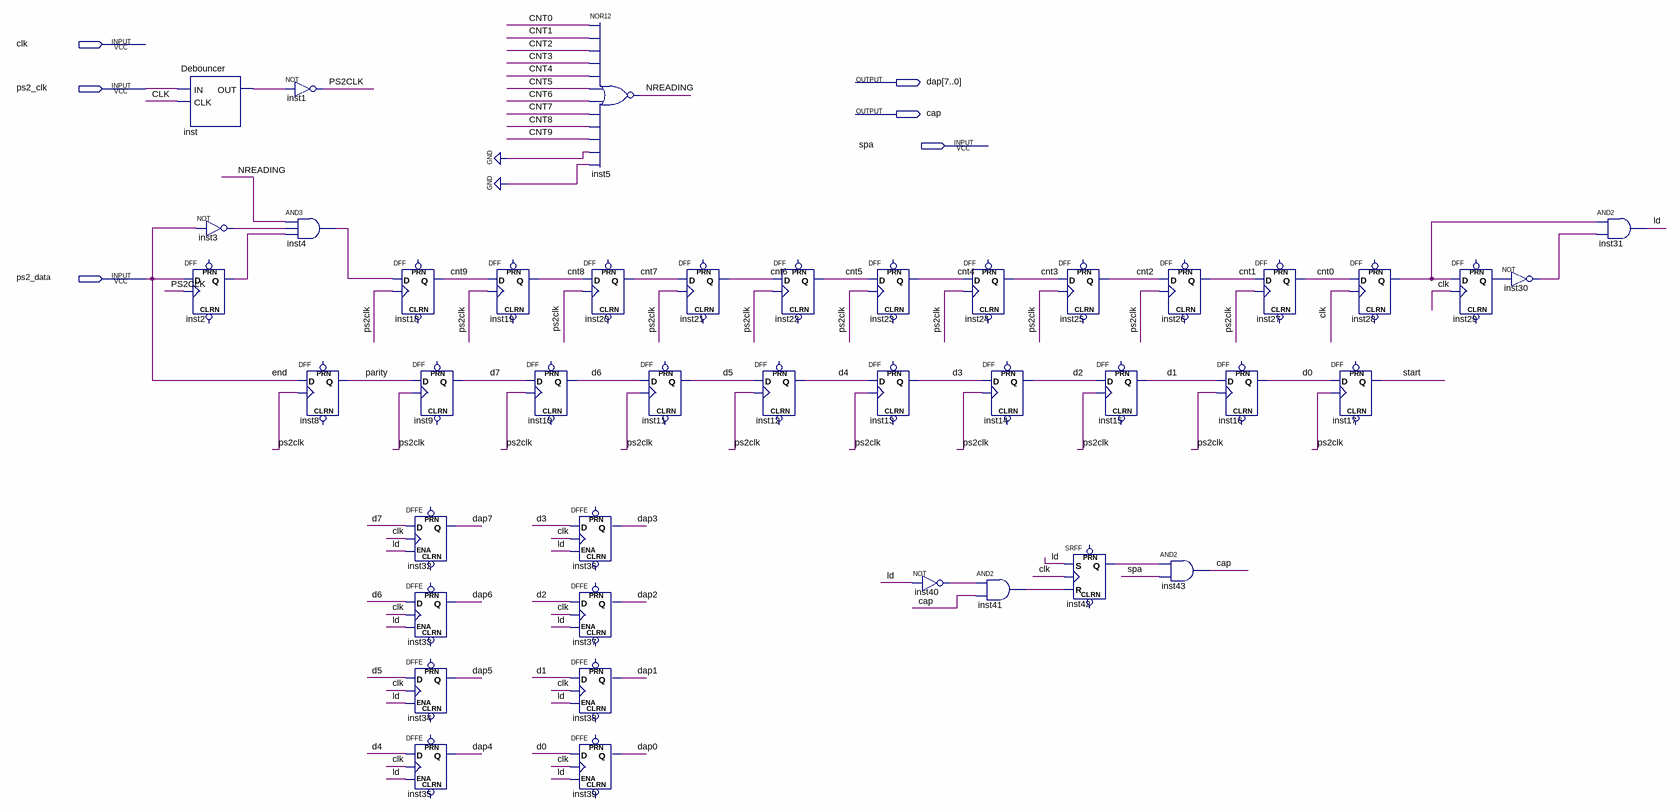
[diagram p0: schematic sheet]
// Quartus schematic UA.bdf as structural Verilog: 42 symbols, 6 pins
module UA (
  input  clk,
  input  ps2_clk,
  input  spa,
  input  ps2_data,
  output [7:0] dap,
  output cap
);

  wire CNT0, CNT1, CNT2, CNT3, CNT4, CNT5, CNT6, CNT7, CNT8, CNT9, d0, d1, d2, d3, d4, d5, d6, d7, inst2_q,
       inst3_out, inst4_out, inst28_q, inst29_q, inst30_out, inst40_out, inst41_out, inst42_q, inst_out, ld,
       NREADING, parity, PS2CLK, start;

  Debouncer inst (.IN(ps2_clk), .CLK(clk), .OUT(inst_out));
  not inst3 (inst3_out, ps2_data);
  DFF inst2 (.CLK(PS2CLK), .D(ps2_data), .Q(inst2_q));  // open: CLRN, PRN
  not inst1 (PS2CLK, inst_out);
  and inst4 (inst4_out, NREADING, inst3_out, inst2_q);
  DFF inst8 (.CLK(PS2CLK), .D(ps2_data), .Q(parity));  // open: CLRN, PRN
  DFF inst18 (.CLK(PS2CLK), .D(inst4_out), .Q(CNT9));  // open: CLRN, PRN
  DFF inst9 (.CLK(PS2CLK), .D(parity), .Q(d7));  // open: CLRN, PRN
  DFFE inst32 (.D(d7), .CLK(clk), .ENA(ld), .Q(dap[7]));  // open: PRN, CLRN
  DFFE inst33 (.D(d6), .CLK(clk), .ENA(ld), .Q(dap[6]));  // open: PRN, CLRN
  DFFE inst34 (.D(d5), .CLK(clk), .ENA(ld), .Q(dap[5]));  // open: PRN, CLRN
  DFFE inst35 (.D(d4), .CLK(clk), .ENA(ld), .Q(dap[4]));  // open: PRN, CLRN
  DFF inst19 (.CLK(PS2CLK), .D(CNT9), .Q(CNT8));  // open: CLRN, PRN
  DFF inst10 (.CLK(PS2CLK), .D(d7), .Q(d6));  // open: CLRN, PRN
  DFF inst20 (.CLK(PS2CLK), .D(CNT8), .Q(CNT7));  // open: CLRN, PRN
  DFFE inst36 (.D(d3), .CLK(clk), .ENA(ld), .Q(dap[3]));  // open: PRN, CLRN
  DFFE inst37 (.D(d2), .CLK(clk), .ENA(ld), .Q(dap[2]));  // open: PRN, CLRN
  DFFE inst38 (.D(d1), .CLK(clk), .ENA(ld), .Q(dap[1]));  // open: PRN, CLRN
  DFFE inst39 (.D(d0), .CLK(clk), .ENA(ld), .Q(dap[0]));  // open: PRN, CLRN
  nor inst5 (NREADING, CNT0, CNT1, CNT2, CNT3, CNT4, CNT5, CNT6, CNT7, CNT8, CNT9, 1'b0, 1'b0);
  DFF inst21 (.CLK(PS2CLK), .D(CNT7), .Q(CNT6));  // open: CLRN, PRN
  DFF inst11 (.CLK(PS2CLK), .D(d6), .Q(d5));  // open: CLRN, PRN
  DFF inst22 (.CLK(PS2CLK), .D(CNT6), .Q(CNT5));  // open: CLRN, PRN
  DFF inst12 (.CLK(PS2CLK), .D(d5), .Q(d4));  // open: CLRN, PRN
  DFF inst23 (.CLK(PS2CLK), .D(CNT5), .Q(CNT4));  // open: CLRN, PRN
  DFF inst13 (.CLK(PS2CLK), .D(d4), .Q(d3));  // open: CLRN, PRN
  not inst40 (inst40_out, ld);
  DFF inst24 (.CLK(PS2CLK), .D(CNT4), .Q(CNT3));  // open: CLRN, PRN
  DFF inst14 (.CLK(PS2CLK), .D(d3), .Q(d2));  // open: CLRN, PRN
  and inst41 (inst41_out, inst40_out, cap);
  DFF inst25 (.CLK(PS2CLK), .D(CNT3), .Q(CNT2));  // open: CLRN, PRN
  SRFF inst42 (.S(ld), .R(inst41_out), .CLK(clk), .Q(inst42_q));  // open: PRN, CLRN
  DFF inst15 (.CLK(PS2CLK), .D(d2), .Q(d1));  // open: CLRN, PRN
  DFF inst26 (.CLK(PS2CLK), .D(CNT2), .Q(CNT1));  // open: CLRN, PRN
  and inst43 (cap, inst42_q, spa);
  DFF inst16 (.CLK(PS2CLK), .D(d1), .Q(d0));  // open: CLRN, PRN
  DFF inst27 (.CLK(PS2CLK), .D(CNT1), .Q(CNT0));  // open: CLRN, PRN
  DFF inst17 (.CLK(PS2CLK), .D(d0), .Q(start));  // open: CLRN, PRN
  DFF inst28 (.CLK(clk), .D(CNT0), .Q(inst28_q));  // open: CLRN, PRN
  DFF inst29 (.CLK(clk), .D(inst28_q), .Q(inst29_q));  // open: CLRN, PRN
  not inst30 (inst30_out, inst29_q);
  and inst31 (ld, inst28_q, inst30_out);

  // Other names for the same wires on the sheet: end = ps2_data
endmodule
